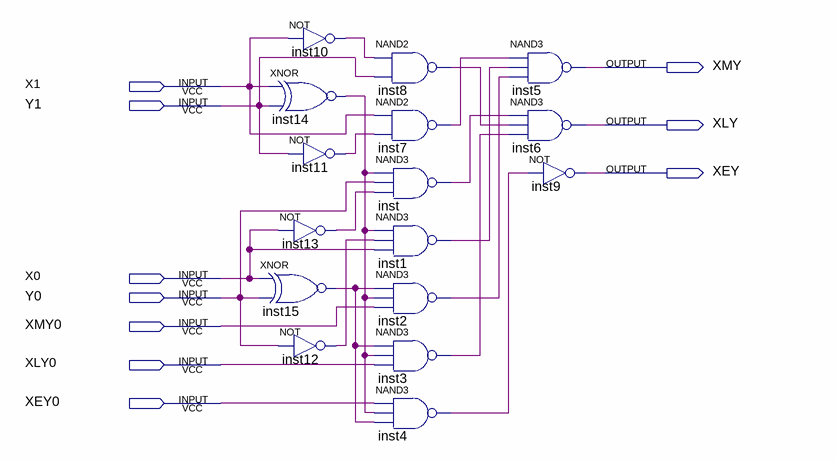
[diagram p0: schematic sheet]
// Quartus schematic Comp_sch.bdf as structural Verilog: 16 symbols, 10 pins
module Comp_sch (
  input  X1,
  input  Y1,
  input  X0,
  input  Y0,
  input  XMY0,
  input  XLY0,
  input  XEY0,
  output XMY,
  output XLY,
  output XEY
);

  wire inst1_out, inst2_out, inst3_out, inst4_out, inst7_out, inst8_out, inst10_out, inst11_out, inst12_out,
       inst13_out, inst14_out, inst15_out, inst_out;

  xnor inst14 (inst14_out, X1, Y1);
  not inst13 (inst13_out, X0);
  xnor inst15 (inst15_out, X0, Y0);
  not inst12 (inst12_out, Y0);
  not inst10 (inst10_out, X1);
  not inst11 (inst11_out, Y1);
  nand inst8 (inst8_out, inst10_out, Y1);
  nand inst7 (inst7_out, X1, inst11_out);
  nand inst (inst_out, inst14_out, Y0, inst13_out);
  nand inst1 (inst1_out, inst14_out, inst12_out, X0);
  nand inst2 (inst2_out, inst15_out, inst14_out, XMY0);
  nand inst3 (inst3_out, inst15_out, inst14_out, XLY0);
  nand inst4 (inst4_out, XEY0, inst14_out, inst15_out);
  nand inst5 (XMY, inst7_out, inst1_out, inst2_out);
  nand inst6 (XLY, inst_out, inst8_out, inst3_out);
  not inst9 (XEY, inst4_out);
endmodule
